# Altium schematic sheet TopLevel.SchDoc
size A; SheetNumber: 1
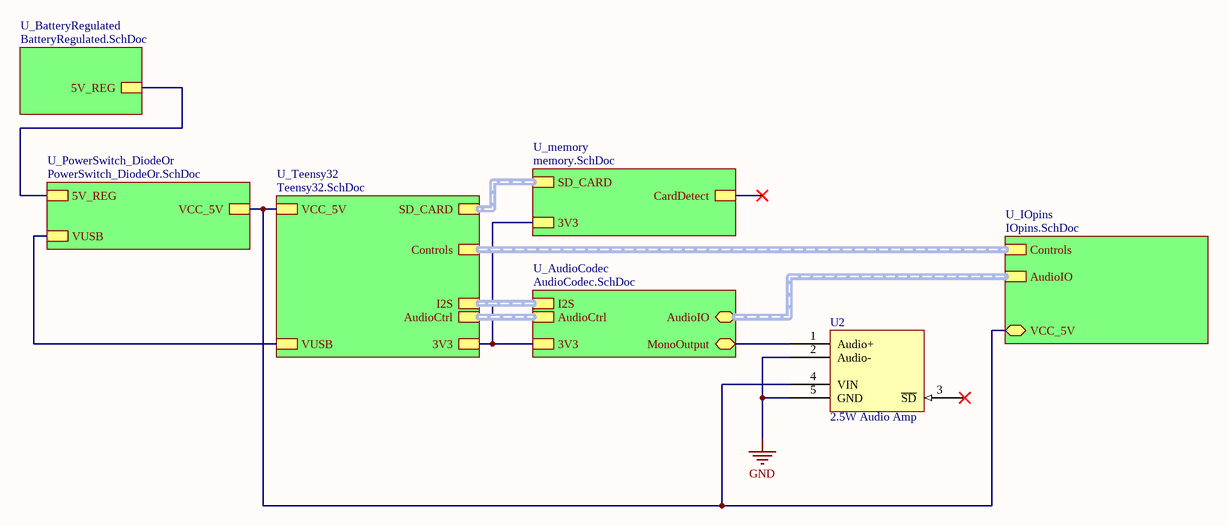
[diagram p0: TopLevel.SchDoc]

## Parts
U2  2.5W Audio Amp  [Adafruit_PAM8302A]

## Sub-sheets
U_AudioCodec = AudioCodec.SchDoc: 3V3, I2S (harness I2S), AudioCtrl (harness AudioCtrl), AudioIO (harness AudioIO), MonoOutput
U_BatteryRegulated = BatteryRegulated.SchDoc: 5V_REG
U_IOpins = IOpins.SchDoc: AudioIO (harness AudioIO), Controls (harness Controls), VCC_5V
U_memory = memory.SchDoc: SD_CARD (harness SD_CARD), 3V3, CardDetect
U_PowerSwitch_DiodeOr = PowerSwitch_DiodeOr.SchDoc: 5V_REG, VCC_5V, VUSB
U_Teensy32 = Teensy32.SchDoc: 3V3, SD_CARD (harness SD_CARD), I2S (harness I2S), Controls (harness Controls), VUSB, VCC_5V, AudioCtrl (harness AudioCtrl)

## Nets
GND: U2.2(Audio-) U2.5(GND)
NetU2_1: U2.1(Audio+) ; sheet U_AudioCodec/MonoOutput
NetU2_4: U2.4(VIN) ; sheet U_Teensy32/VCC_5V, sheet U_PowerSwitch_DiodeOr/VCC_5V, sheet U_IOpins/VCC_5V
(unnamed): sheet U_Teensy32/3V3, sheet U_AudioCodec/3V3, sheet U_memory/3V3
(unnamed): sheet U_Teensy32/VUSB, sheet U_PowerSwitch_DiodeOr/VUSB
(unnamed): sheet U_PowerSwitch_DiodeOr/5V_REG, sheet U_BatteryRegulated/5V_REG

Not connected (* = marked no-connect by the designer): U2 3(~{SD})*

## Buses and harness runs
harness sheet U_AudioCodec/AudioCtrl = sheet U_Teensy32/AudioCtrl
harness sheet U_AudioCodec/AudioIO = sheet U_IOpins/AudioIO
harness sheet U_AudioCodec/I2S = sheet U_Teensy32/I2S
harness sheet U_IOpins/Controls = sheet U_Teensy32/Controls
harness sheet U_memory/SD_CARD = sheet U_Teensy32/SD_CARD

## Library data of the parts
U2 = Adafruit_PAM8302: 2.5W Class D Audio Amplifier